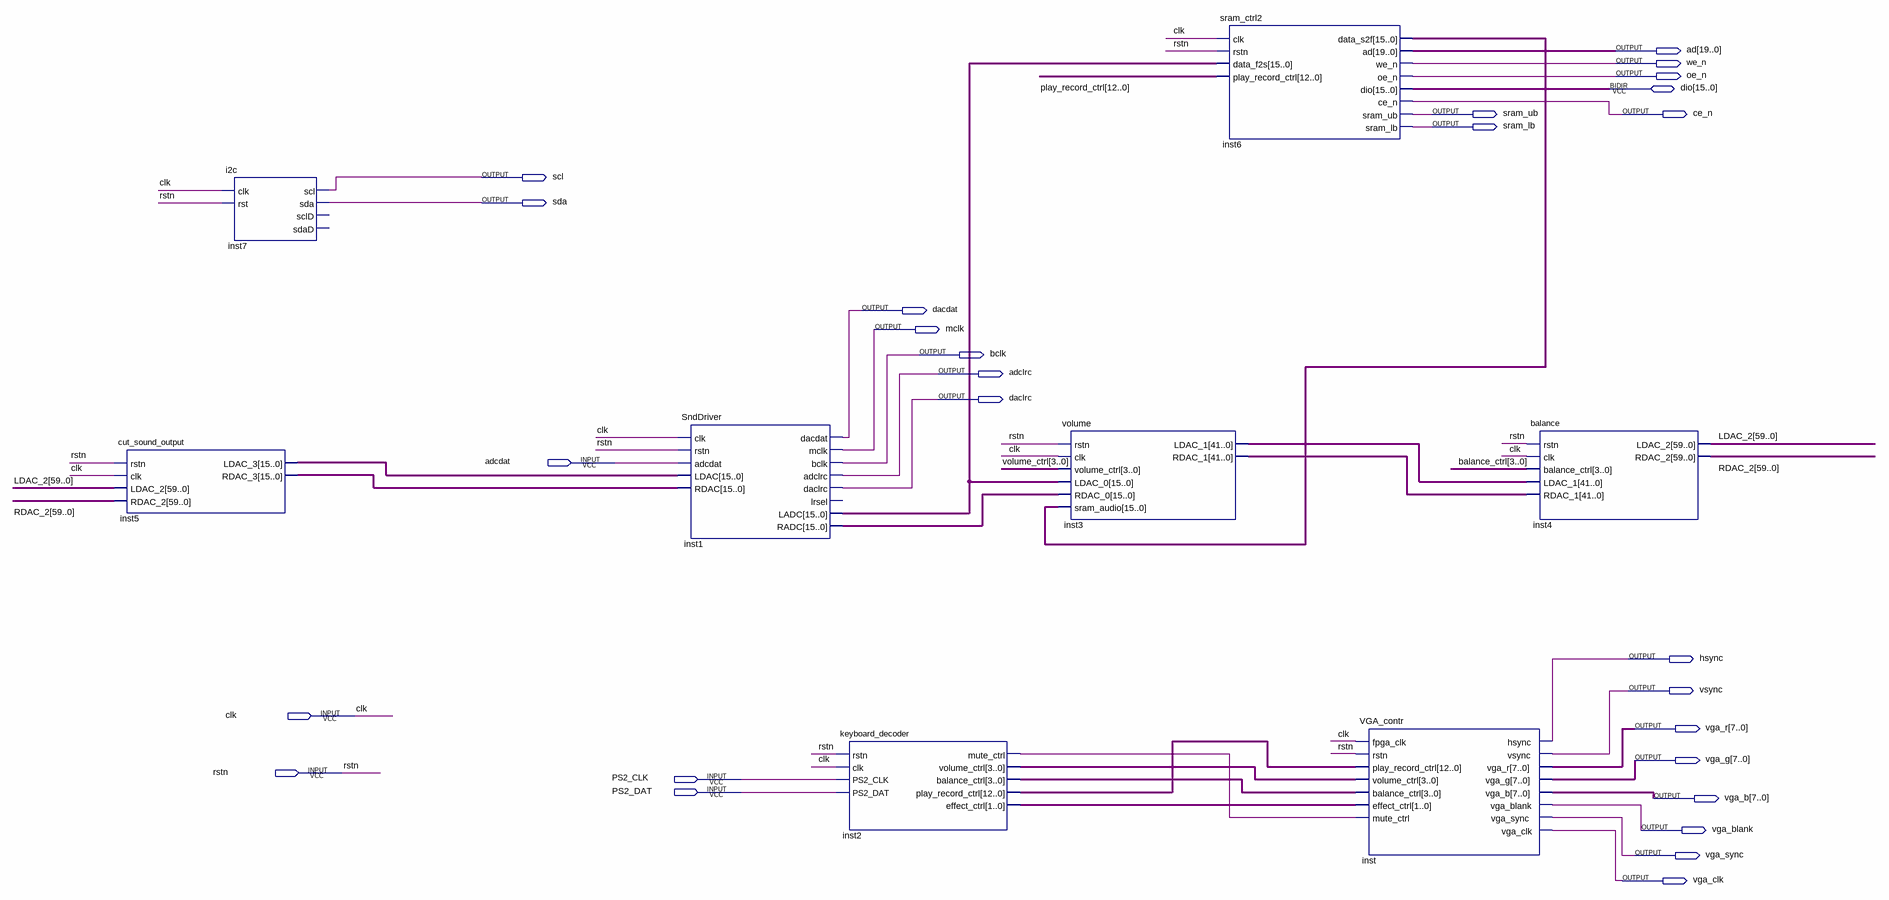
[diagram p0: schematic sheet]
// Quartus schematic Soundpad.bdf as structural Verilog: 8 symbols, 27 pins
module Soundpad (
  input  adcdat,
  input  clk,
  input  rstn,
  input  PS2_CLK,
  input  PS2_DAT,
  inout  [15:0] dio,
  output [19:0] ad,
  output we_n,
  output oe_n,
  output sram_ub,
  output ce_n,
  output sram_lb,
  output scl,
  output sda,
  output dacdat,
  output mclk,
  output bclk,
  output adclrc,
  output daclrc,
  output hsync,
  output vsync,
  output [7:0] vga_r,
  output [7:0] vga_g,
  output [7:0] vga_b,
  output vga_blank,
  output vga_sync,
  output vga_clk
);

  wire inst2_mute_ctrl;
  wire [1:0] inst2_effect_ctrl;
  wire [3:0] balance_ctrl, volume_ctrl;
  wire [12:0] play_record_ctrl;
  wire [15:0] inst1_ladc, inst1_radc, inst5_ldac_3, inst5_rdac_3, inst6_data_s2f;
  wire [41:0] inst3_ldac_1, inst3_rdac_1;
  wire [59:0] LDAC_2, RDAC_2;

  cut_sound_output inst5 (
    .rstn(rstn), .clk(clk), .LDAC_2(LDAC_2), .RDAC_2(RDAC_2), .LDAC_3(inst5_ldac_3), .RDAC_3(inst5_rdac_3));
  i2c inst7 (.clk(clk), .rst(rstn), .scl(scl), .sda(sda));  // open: sclD, sdaD
  SndDriver inst1 (
    .clk(clk), .rstn(rstn), .adcdat(adcdat), .LDAC(inst5_ldac_3), .RDAC(inst5_rdac_3), .dacdat(dacdat),
    .mclk(mclk), .bclk(bclk), .adclrc(adclrc), .daclrc(daclrc), .LADC(inst1_ladc), .RADC(inst1_radc));  // open: lrsel
  keyboard_decoder inst2 (
    .rstn(rstn), .clk(clk), .PS2_CLK(PS2_CLK), .PS2_DAT(PS2_DAT), .mute_ctrl(inst2_mute_ctrl),
    .volume_ctrl(volume_ctrl), .balance_ctrl(balance_ctrl), .play_record_ctrl(play_record_ctrl),
    .effect_ctrl(inst2_effect_ctrl));
  volume inst3 (
    .rstn(rstn), .clk(clk), .volume_ctrl(volume_ctrl), .LDAC_0(inst1_ladc), .RDAC_0(inst1_radc),
    .sram_audio(inst6_data_s2f), .LDAC_1(inst3_ldac_1), .RDAC_1(inst3_rdac_1));
  sram_ctrl2 inst6 (
    .clk(clk), .rstn(rstn), .data_f2s(inst1_ladc), .play_record_ctrl(play_record_ctrl),
    .data_s2f(inst6_data_s2f), .ad(ad), .we_n(we_n), .oe_n(oe_n), .ce_n(ce_n), .sram_ub(sram_ub),
    .sram_lb(sram_lb), .dio(dio));
  VGA_contr inst (
    .fpga_clk(clk), .rstn(rstn), .play_record_ctrl(play_record_ctrl), .volume_ctrl(volume_ctrl),
    .balance_ctrl(balance_ctrl), .effect_ctrl(inst2_effect_ctrl), .mute_ctrl(inst2_mute_ctrl), .hsync(hsync),
    .vsync(vsync), .vga_r(vga_r), .vga_g(vga_g), .vga_b(vga_b), .vga_blank(vga_blank), .vga_sync(vga_sync),
    .vga_clk(vga_clk));
  balance inst4 (
    .rstn(rstn), .clk(clk), .balance_ctrl(balance_ctrl), .LDAC_1(inst3_ldac_1), .RDAC_1(inst3_rdac_1),
    .LDAC_2(LDAC_2), .RDAC_2(RDAC_2));
endmodule
